# EAGLE design CNY70 (EAGLE 6.5.0)
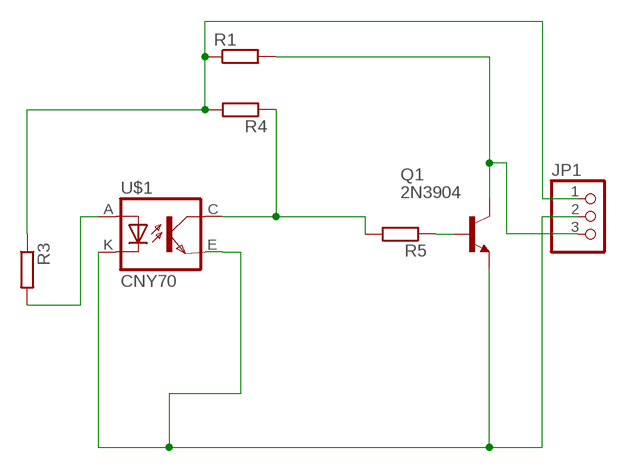
[diagram p0: schematic, sheet 1]

## Parts
JP1  PINHD-1X3  [1X03]
Q1  2N3904  [TO92]
R1  R-EU_0207/10  [0207/10]
R3  R-EU_0207/10  [0207/10]
R4  R-EU_0207/10  [0207/10]
R5  R-EU_0207/10  [0207/10]
U$1  CNY70  [4]

## Nets
N$1: Q1.2(B) R5.1
N$2: JP1.2 Q1.3(E)
N$3: JP1.1 R1.1 R3.1 R4.2
N$5: U$1.E(EMI) U$1.K(C)
N$6: JP1.3 Q1.1(C) R1.2
N$7: R3.2 U$1.A
N$16: R4.1 R5.2 U$1.C(COL)

## Library data of the parts
JP1 = pinhead:PINHD-1X3: PIN HEADER
Q1 = transistor-npn:2N3904: NPN Transistor
R1 R3-R5 = resistor:R-EU_: RESISTOR, European symbol
U$1 = cny70:CNY70

## Board
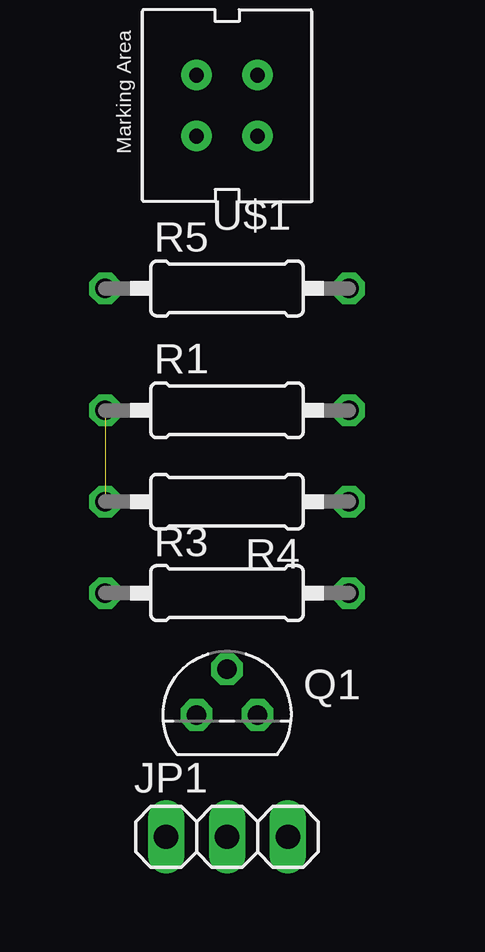
[diagram p1: board, top side]
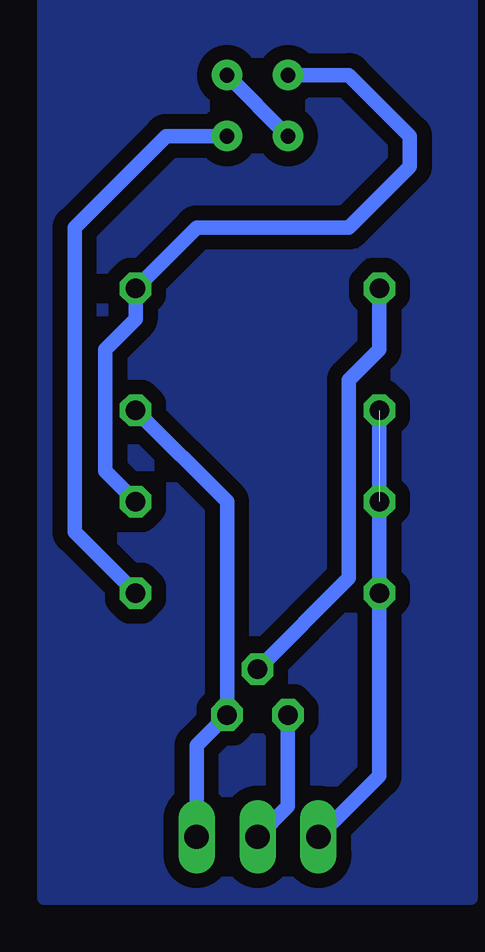
[diagram p2: board, bottom side, seen from below]

No outline drawn. Coordinates in mm, seen from the top.
Copper layers (1*16): Top 0.035mm / dielectric 1.5mm / Bottom 0.035mm
Design rules "default": minimum track width 10mil, minimum drill 24mil, track to track 8mil, track to pad 8mil, pad to pad 8mil, via to via 8mil, smd to smd 8mil, copper to edge 40mil, drill to drill 8mil, minimum pad ring 10mil, minimum via ring 8mil, stop-mask expansion 4mil, vias tented up to drill 0mil, thermal gap 10mil

### Footprints (pad centres in the part's own frame; a part is rotated, then mirrored left to right if it is on the bottom)
1X03 = drill 1.016 long: 1 -2.54,0; 2 0,0; 3 2.54,0
TO92 = drill 0.813 octagon: 1 1.27,0; 2 0,1.905; 3 -1.27,0
0207/10 = drill 0.813 octagon: 1 -5.08,0; 2 5.08,0
4 = drill 0.61 pad 1.27: A -1.27,1.27; C 1.27,-1.27; E 1.27,1.27; K -1.27,-1.27

### Placement (x,y rotation side)
JP1  8.89,2.54 0 top
Q1  8.89,7.62 0 top
R1  8.89,20.32 0 top
R3  8.89,12.7 0 top
R4  8.89,16.51 180 top
R5  8.89,25.4 0 top
U$1  8.89,33.02 180 top

### Tracks (layer width: path | path; a pad name or v marks a point on that pad's centre or on a via)
N$1
  Bottom 0.61: R5.1 3.81,22.86 5.08,21.59 5.08,13.34 Q1.2
N$2
  Bottom 0.61: Q1.3 7.62,3.81 JP1.2
N$3  (1 unrouted)
  Bottom 0.61: R1.1 R3.1 3.81,5.08 JP1.1
N$5
  Bottom 0.61: U$1.E U$1.K
N$6
  Bottom 0.61: R1.2 10.16,16.51 Q1.1 11.43,6.35 JP1.3
N$7
  Bottom 0.61: U$1.A 12.7,31.75 16.51,27.94 16.51,15.24 R3.2
N$13
  pour Bottom (isolate 0.61): 0,39.37 0,0 17.78,0 17.78,39.37
N$16
  Bottom 0.61: U$1.C 5.08,34.29 2.54,31.75 2.54,30.48 5.08,27.94 11.43,27.94 R5.2 13.97,24.13 15.24,22.86 15.24,17.78 R4.1